# Altium schematic sheet 01 - GaN.SchDoc
size A4; SheetNumber: 2; SheetTotal: 3
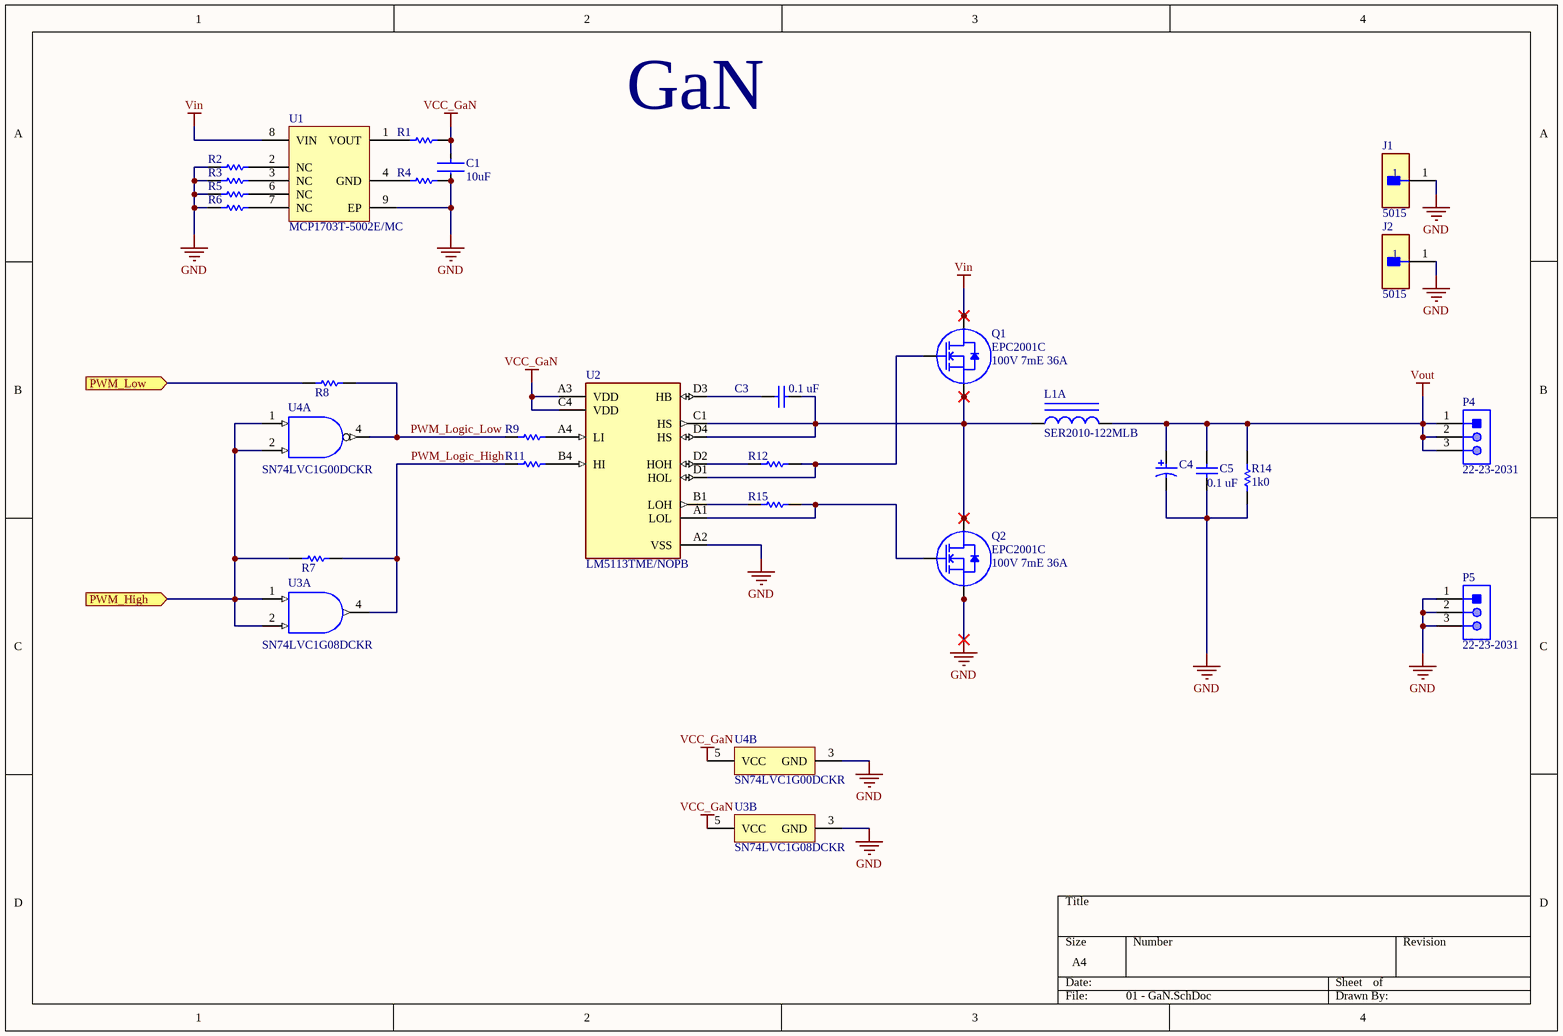
[diagram p0: 01 - GaN.SchDoc]

## Parts
C1  10uF  [FP-C0805C-DG-MFG]
C3  0.1 uF  [CAPC2013X94X50ML20T25]
C4  EEEFK1J470P  [PNSC-FK-V-F_V]  (value not drawn)
C5  0.1 uF  [CAPC2013X94X50ML20T25]
J1  5015  [FP-5015-MFG]
J2  5015  [FP-5015-MFG]
L1  SER2010-122MLB  [COIL-SER2010-3_V]  (part A of 2)
P4  22-23-2031  [MOLX-22-23-2031_V]
P5  22-23-2031  [MOLX-22-23-2031_V]
Q1  EPC2001C  [D0188]
Q2  EPC2001C  [D0188]
R1  CRCW02010000Z0ED  [RESC0603X28X15NL5T05]  (value not drawn)
R2  CRCW02010000Z0ED  [RESC0603X28X15NL5T05]  (value not drawn)
R3  CRCW02010000Z0ED  [RESC0603X28X15NL5T05]  (value not drawn)
R4  CRCW02010000Z0ED  [RESC0603X28X15NL5T05]  (value not drawn)
R5  CRCW02010000Z0ED  [RESC0603X28X15NL5T05]  (value not drawn)
R6  CRCW02010000Z0ED  [RESC0603X28X15NL5T05]  (value not drawn)
R7  CRCW02010000Z0ED  [RESC0603X28X15NL5T05]  (value not drawn)
R8  CRCW02010000Z0ED  [RESC0603X28X15NL5T05]  (value not drawn)
R9  CRCW02010000Z0ED  [RESC0603X28X15NL5T05]  (value not drawn)
R11  CRCW02010000Z0ED  [RESC0603X28X15NL5T05]  (value not drawn)
R12  CRCW02010000Z0ED  [RESC0603X28X15NL5T05]  (value not drawn)
R14  Valor/Partnumber: 1k0  [0805]  (hidden comment: 1k0 SMD 0805)
R15  CRCW02010000Z0ED  [RESC0603X28X15NL5T05]  (value not drawn)
U1  MCP1703T-5002E/MC  [DFN-MC8]
U2  LM5113TME/NOPB  [FP-YFX0012-MFG]
U3  SN74LVC1G08DCKR  [DCK0005A_M]  (parts A,B of 2)
U4  SN74LVC1G00DCKR  [DCK0005A_M]  (parts A,B of 2)

## Ports
PWM_High (in), PWM_Low (in)

## Nets
GND: C1.2 C4.2 C5.1 J1.1 J2.1 P5.1 P5.2 P5.3 Q2.2(Sub) Q2.4(S1) Q2.6(S2) Q2.8(S3) Q2.10(S4) R2.1 R3.1 R4.2 R5.1 R6.1 R14.1 U1.9(EP) U2.A2(VSS) U3.3(GND) U4.3(GND)
VCC_GaN: C1.1 R1.2 U2.A3(VDD) U2.C4(VDD) U3.5(VCC) U4.5(VCC)
Vin: Q1.3(D1) Q1.5(D2) Q1.7(D3) Q1.9(D4) Q1.11(D5) U1.8(VIN)
Vout: C4.1 C5.2 L1.2 P4.1 P4.2 P4.3 R14.2
PWM_High: R7.2 U3.1(A) U3.2(B) U4.1(A) U4.2(B) ; port PWM_High
PWM_Logic_High: R7.1 R11.1 U3.4(Y)
PWM_Logic_Low: R8.1 R9.1 U4.4(Y)
PWM_Low: R8.2 ; port PWM_Low
NetC3_1: C3.1 U2.D3(HB)
NetC3_2: C3.2 L1.1 Q1.2(Sub) Q1.4(S1) Q1.6(S2) Q1.8(S3) Q1.10(S4) Q2.3(D1) Q2.5(D2) Q2.7(D3) Q2.9(D4) Q2.11(D5) U2.C1(HS) U2.D4(HS)
NetQ1_1: Q1.1(G) R12.2 U2.D1(HOL)
NetQ2_1: Q2.1(G) R15.2 U2.A1(LOL)
NetR1_1: R1.1 U1.1(VOUT)
NetR2_2: R2.2 U1.2(NC)
NetR3_2: R3.2 U1.3(NC)
NetR4_1: R4.1 U1.4(GND)
NetR5_2: R5.2 U1.6(NC)
NetR6_2: R6.2 U1.7(NC)
NetR9_2: R9.2 U2.A4(LI)
NetR11_2: R11.2 U2.B4(HI)
NetR12_1: R12.1 U2.D2(HOH)
NetR15_1: R15.1 U2.B1(LOH)

## Notes on the sheet
- GaN

## Library data of the parts
C1 = CMP-2007-03243-2: CAP CER 10UF 10V X5R 0805; Manufacturer Part Number: C0805C106K8PACTU; Manufacturer: Kemet; 3DS Part Number: 220-00001; Tolerance: 10%; Temperature Coefficient: 15%; Material: Ceramic; Device Class L2: Capacitors; Device Class L1: Passive Components; ComponentLink2URL: https://content.kemet.com/datasheets/KEM_C1006_X5R_SMD.pdf; Height: 1.4mm; Lead Free: Yes; Digikey Description: CAP CER 10UF 10V X5R 0805; Octopart: https://octopart.com/c0805c106k8pactu-kemet-98697; Capacitance: 10uF; Value: 10uF; Temperature Range Low: -55°C; Temperature: -55°C to +85°C; Automotive: No; Mouser Description: CAP CER 10UF 10V X5R 0805; Ipc Land Pattern Name: CAPC200125X125; Temperature Range High: +85°C; Voltage: 10V; RoHS: TRUE; Device Class L3: Ceramic Capacitors; ComponentLink2Description: Datasheet; Voltage Rating: 10V; Package: C0805C-DG; Temperature Characteristic: X5R; Category: Cap
C3 C5 = CMP-2000-05016-1: Chip Capacitor, Ceramic, 0.1 uF, 10%, 50 V, 0805, RoHS, Tape and Reel; Manufacturer: AVX; Rated Voltage: 50V; Capacitance: 100nF; Dielectric: X7R; Case Size/Dimension: 0805; Tolerance (%): ±10%; Datasheet URL: http://www.farnell.com/datasheets/319609.pdf; Datasheet Version: Sep-07; Manufacturer URL: http://www.avx.com/
C4 = CMP-2000-06210-1: Aluminum Electrolytic Capacitor, 47 uF, +/- 20%, 63 V, 2-Pin SMD (Size Code F), -55 to 105 degC, RoHS, Tape and Reel; Manufacturer: Panasonic; External Length / Height: 10.2mm; Power Factor: 0.08; AE Capacitor Case: RadialCan-SMD; Operating Lifetime: 2000h; Voltage Rating: 63V; SVHC: NoSVHC(16-Dec-2013); Life Time @ Temperature: 2000hours@105°C; Ripple Current AC: 250mA; Ripple Current Frequency: 100kHz; Power Factor Frequency: 120Hz; Capacitance: 47µF; Impedance: 0.65ohm; Product Range: PANASONIC-FKSeries; Ripple Current Temperature: 105°C; Package Description: 2-Pin Electrolytic Aluminum Capacitor, Body 8.3 x 8.3 mm; Package Reference: FK-V-F; Mounting Technology: SurfaceMount; Operating Temperature Min: -55°C; Capacitor Case Style: SMD; Datasheet URL: http://industrial.panasonic.com/cdbs/www-data/pdf/RDE0000/ABA0000C1181.pdf; Package / Case: F; Capacitance Tolerance ±: ±20%; Packaging: CutTape; Operating Temperature Max: 105°C; Voltage Rating V DC: 63V; Datasheet Version: 03/2016; Tolerance +: 20%; Diameter: 8mm; Tolerance -: 20%; Capacitor Terminals: SMD; Manufacturer URL: http://www.panasonic.com/; Operating life Time: 2000h; Lifetime @ Temperature: 2000hours@105°C; Package URL: http://industrial.panasonic.com/cdbs/www-data/pdf/RDE0000/DME0000COL48.pdf; Height: 10.2mm; Operating Temperature Range: -55°Cto+105°C; Series: FK; Capacitance Tolerance: ±20%
J1 J2 = CMP-2000-05183-2: PC TEST POINT MINIATURE; Manufacturer: keystone; Number Of Contacts: 1; Conn Orientation: Straight; Category: Conn; Manufacturer Part Number: 5015; Digikey Description: PC TEST POINT MINIATURE; Automotive: No; Lead Free: Yes; Octopart: https://octopart.com/5015-keystone-3822; ComponentLink2URL: http://www.keyelco.com/product-pdf.cfm?p=1353; Package: 5015; RoHS: TRUE; Device Class L3: unset; Device Class L2: unset; Contact Material: Silver; Device Class L1: Connectors; Height: 1.65mm; ComponentLink2Description: Datasheet
L1 = CMP-0837-00016-1: Shielded Power Inductor, 1.2 uH, +/- 20%, 0.9 mOhm, 69 MHz, 37 A, -40 to 125 degC, 3-Pin SMD, RoHS; Manufacturer: Coilcraft; Isat (A): 37; Inductance +/- 20% (uH): 1.2; Packing: Less than full reel; DCR typ (mOhm): 0.9; SRF typ (MHz): 69; ComponentLink3Description: Package Specification; DatasheetVersion: 09/2012; ComponentLink2Description: Datasheet; ComponentLink3URL: http://www.coilcraft.com/pdfs/ser2000.pdf; Ambient Temperature with Irms Current: -40 to 85 degC; Ambient Temperature with Derated Current: 85 to 125 degC; PartNumber: SER2010-122MLB; RoHS: TRUE; Mounting Technology: Surface Mount; ComponentLink1Description: Manufacturer URL; PackageReference: SER2010-3; ComponentLink2URL: http://www.coilcraft.com/pdfs/ser2000.pdf; ComponentLink1URL: http://www.coilcraft.com/; PackageVersion: 09/2012; PackageDescription: 3-Pin SMD, Body 19.18 x 9.27 mm, Height 9.4 mm
P4 P5 = CMP-2000-05242-1: Male Header, Pitch 2.54 mm, 1 x 3 Position, Height 8.18 mm, Tail Length 3.56 mm, RoHS, Bulk; Current Rating: 4A; Brand: Molex; Pitch: 2.54mm; Voltage Rating: 250V; Mounting Angle: Vertical; Type: Locking; Factory Pack Quantity: 16000; Tradename: KK; Housing Material: Nylon; Contact Material: Brass; Manufacturer URL: http://www.molex.com/; Termination Style: ThroughHole; Mounting Style: ThroughHole; Number of Positions: 3Position; Contact Gender: Pin(Male); Packaging: Bulk; Series: 6373; Datasheet Version: Sep-01; Contact Plating: Tin; Product: Headers; Datasheet URL: https://datasheet.ciiva.com/19472/232274-19472863.pdf; RoHS: Details; Product Category: Headers&WireHousings; Manufacturer: Molex; Number of Rows: 1Row
Q1 Q2 = EPC2001C: 100V 7mE 36A; MFG: EPC; Part Number: EPC2001C; EPC Part Number: EPC2001C; Config: *; Status: Released; MFGPN: EPC2001C; Supplier 1: Digi-Key; Supplier Part Number 1: 917-1079-2-ND; Supplier 2: Digi-Key; Supplier Part Number 2: 917-1079-1-ND; Supplier 3: Digi-Key; Supplier Part Number 3: 917-1079-6-ND; QSGdescript: 100V 7mE 36A; SchDescript: 100V 7mE 36A
R1-R9 R11 R12 R15 = CMP-2004-00001-2: Chip Resistor, 0 Ohm, Jumper, 0.05 W, -55 to 155 degC, 0201 (0603 Metric), RoHS, Tape and Reel; Voltage Rating: 30 V; Case\Package: 0201; Resistance: 0 mohm; Tolerance: 5%; Power Rating: 50 mW; REACH SVHC: Unknown; Length: 0.6 mm; Packaging: Cut Tape; Weight: 6E-06 oz; ComponentLink2URL: http://www.vishay.com/docs/20052/crcw0201e3.pdf; Mounting Technology: Surface Mount; Case Code (Imperial): 0201; Radiation Hardening: No; RoHSCompliant: true; Package Quantity: 1; Min Operating Temperature: -55 degC; Height: 0.23 mm; PackageReference: 0201; ComponentLink1Description: Manufacturer URL; ComponentLink2Description: Datasheet; Case Code (Metric): 0603; DatasheetVersion: 03/2016; Width: 0.3 mm; Mount: Surface Mount; PackageDescription: 2-Pin Surface Mount Device, Body 0.6 x 0.3 mm; ComponentLink1URL: http://www.vishay.com/; Max Operating Temperature: 155 degC
R14 = 1k0 SMD 0805: Resistor SMD 0805 1/8W; Tolerância: 5%; Potência: 1/8W; Montagem: SMD
U1 = CMP-0136-00281-1: 250 mA, 16V, Low Quiescent Current LDO Regulator, 8-Pin DFN, Extended Temperature, Tape and Reel; PackageDescription: 8-Lead Plastic Dual Flat, No Lead Package (MC) - 2x3x0.9mm Body [DFN]; PackageReference: DFN-MC8; PackageVersion: revBB, Aug-2009; DatasheetVersion: revD, Sep-2009
U2 = CMP-04912-000040-1: IC GATE DRVR HALF-BRIDGE 12DSBGA; Turn-On Delay Time: 28ns; Number of Drivers: 2; Turn-Off Delay Time: 26.5ns; Max Output Current: 5A; Rise Time: 7ns; Fall Time: 1.5ns; Min Supply Voltage: 4.5V; Max Supply Voltage: 5.5V; Operating Supply Current: 2mA; RoHS Compliant: Yes; REACH SVHC: No SVHC; Lead Free: Lead Free; Number of Outputs: 2; Packaging: Tape and Reel; Number of Channels: 2; Max Operating Temperature: 125°C; Min Operating Temperature: -40°C; Mount: Surface Mount; Output Current: 5A; Series: LM5113; Package Quantity: 250; Number of Pins: 12
U3 = CMP-0859-00266-3: Single 2-Input Positive-AND Gate, DCK0005A, LARGE T&R; Manufacturer: Texas Instruments; tpd @ Nom Voltage(Max)(ns): 4.5,6,4,5; F @ Nom Voltage(Max)(Mhz): 150; ICC @ Nom Voltage(Max)(mA): 0.01; Bits(#): 1; VCC(Min)(V): 1.65; Gate Type: AND; Rating: Catalog; Output Type: CMOS; Voltage(Nom)(V): 1.8,2.5,3.3,5; Technology Family: LVC; VCC(Max)(V): 5.5; Input Type: CMOS/TTL; Schmitt Trigger: No; Output Drive (IOL/IOH)(Max)(mA): 32/-32; Logic: True; Generic Part Number: SN74LVC1G08; DatasheetVersion: SCES217Y; Sub-Family: AND Gate; 3-State Output: No; Operating Temperature Range(C): -40 to 125,-40 to 85; PackageReference: DCK0005A
U4 = CMP-0859-00364-3: Single 2 Input Positive NAND Gate, DCK0005A, LARGE T&R; Manufacturer: Texas Instruments; Output Type: CMOS; ICC @ Nom Voltage(Max)(mA): 0.01; 3-State Output: No; Input Type: CMOS/TTL; VCC(Min)(V): 1.65; Technology Family: LVC; Bits(#): 1; Output Drive (IOL/IOH)(Max)(mA): 32/-32; F @ Nom Voltage(Max)(Mhz): 150; Voltage(Nom)(V): 1.8,2.5,3.3,5; Logic: True; Rating: Catalog; tpd @ Nom Voltage(Max)(ns): 9,5.5,4.7,4; VCC(Max)(V): 5.5; Gate Type: NAND; DatasheetVersion: SCES212AB; PackageReference: DCK0005A; Sub-Family: NAND Gate; Operating Temperature Range(C): -40 to 125,-40 to 85; Generic Part Number: SN74LVC1G00; Schmitt Trigger: No